# Altium schematic sheet power.schdoc
size 148 x 104 mm
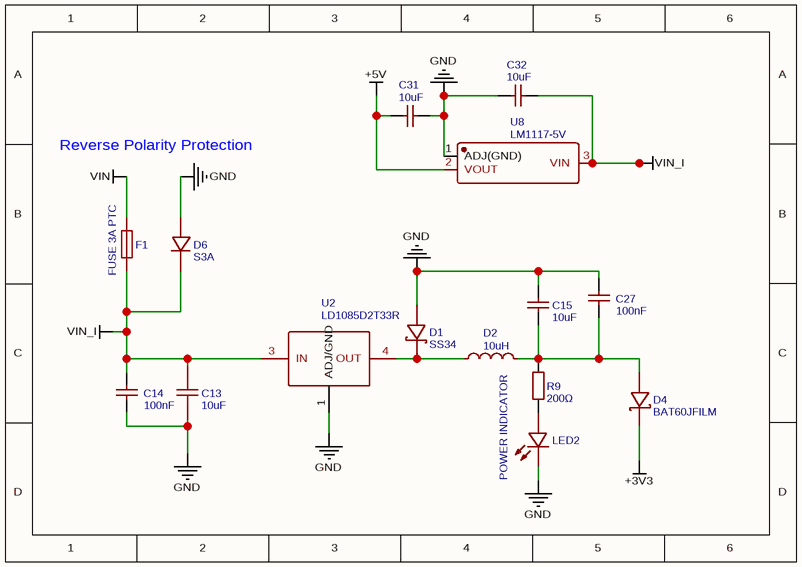
[diagram p0: power.schdoc]

## Parts
C13  10uF  [C0603]
C14  100nF  [C0402]
C15  10uF  [C0402]
C27  100nF  [C0402]
C31  10uF  [C0402]
C32  10uF  [C0402]
D1  SS34  [SMC_L7.1-W6.2-LS8.1-R-RD]
D2  10uH  [IND-SMD_L12.5-W12.5-SRR1280-150M]
D4  BAT60JFILM  [SOD-323_L1.8-W1.3-LS2.5-RD]
D6  S3A  [SMB_L4.6-W3.6-LS5.3-RD]
F1  FUSE 3A PTC  [F1210]
LED2  POWER INDICATOR  [LED0603-RD]
R9  200Ω  [R0402]
U2  LD1085D2T33R  [TO-263-2_L10.0-W9.1-P5.08-LS15.2-TL]
U8  LM1117-5V  [SOT-89-3_L4.5-W2.5-P1.50-LS4.1-BR]

## Nets
+3V3: D4.1(K)
+5V: C31.2 U8.2(VOUT)
GND: C13.2 C14.1 C15.1 C27.2 C31.1 C32.2 D1.1(A) D6.2 LED2.1(K) U2.1(ADJ/GND) U8.1(ADJ(GND))
VIN: F1.2
VIN_I: C13.1 C14.2 C32.1 D6.1 F1.1 U2.3(IN) U8.3(VIN)
NetC15_2: C15.2 C27.1 D2.2 D4.2(A) R9.1
NetD1_2: D1.2(K) D2.1 U2.4(OUT)
NetLED2_2: LED2.2(A) R9.2

## Notes on the sheet
- Reverse Polarity Protection

## Library data of the parts
C13 = 10uF: Manufacturer: SAMSUNG(三星); Manufacturer Part: CL10A106MA8NRNC; nameAlias: Value; Supplier: LCSC; Supplier Part: C96446; JLCPCB Part Class: Basic Part; spicePre: C; spiceSymbolName: CL10A106MA8NRNC
C14 C27 = 100nF: Manufacturer Part: CL05B104KO5NNNC; Manufacturer: SAMSUNG(三星); nameAlias: Value; Supplier: LCSC; Supplier Part: C1525; JLCPCB Part Class: Basic Part; spicePre: C; spiceSymbolName: CL05B104KO5NNNC
C15 C31 C32 = 10uF: Manufacturer Part: CL05A106MQ5NUNC; Manufacturer: SAMSUNG(三星); nameAlias: Value; Supplier: LCSC; Supplier Part: C15525; JLCPCB Part Class: Basic Part; spicePre: C; spiceSymbolName: CL05A106MQ5NUNC
D1 = SS34: Manufacturer Part: SS34C; Manufacturer: MDD; Supplier: LCSC; Supplier Part: C13763; JLCPCB Part Class: Extended Part; spicePre: D; spiceSymbolName: SS34
D2 = 10uH: Manufacturer: BOURNS; Manufacturer Part: SRR1280-150M; Contributor: LCSC; nameAlias: Value; Supplier: LCSC; Supplier Part: C2041428; JLCPCB Part Class: Extended Part; spicePre: D; spiceSymbolName: SRR1280-150M
D4 = BAT60JFILM: Manufacturer: ST(意法半导体); Contributor: LCSC; Supplier: LCSC; Manufacturer Part: BAT60JFILM; Supplier Part: C133103; JLCPCB Part Class: Extended Part; spicePre: D; spiceSymbolName: BAT60JFILM
D6 = S3A: Manufacturer: LGE(鲁光); Contributor: LCSC; JLCPCB Part Class: Extended Part; Supplier: LCSC; Supplier Part: C330468; Manufacturer Part: S3A; spicePre: D; spiceSymbolName: S3A
F1 = FUSE 3A PTC: Manufacturer: 台湾陆海; Manufacturer Part: SL1210380; Supplier: LCSC; Supplier Part: C70185; JLCPCB Part Class: Extended Part; spicePre: F; spiceSymbolName: SL1210380
LED2 = POWER INDICATOR: Manufacturer: KENTO; Manufacturer Part: KT-0603R; Supplier: LCSC; Supplier Part: C2286; JLCPCB Part Class: Basic Part; spicePre: L; spiceSymbolName: KT-0603R
R9 = 200Ω: Manufacturer: UNI-ROYAL(厚声); Manufacturer Part: 0402WGF2000TCE; nameAlias: Value; Supplier: LCSC; Supplier Part: C25087; JLCPCB Part Class: Basic Part; spicePre: R; spiceSymbolName: 0402WGF2000TCE
U2 = LD1085D2T33R: Manufacturer: ST(意法半导体); Supplier: LCSC; Manufacturer Part: LD1085D2T33R; Supplier Part: C7913; JLCPCB Part Class: Extended Part; spicePre: U; spiceSymbolName: LD1085D2T33R
U8 = LM1117-5V: Manufacturer: null; Contributor: lcsc; Supplier: LCSC; Supplier Part: C3038697; Manufacturer Part: LM1117-5V; JLCPCB Part Class: Extended Part; spicePre: U; spiceSymbolName: LM1117-5V